# EAGLE design Blinkenlights (EAGLE 9.6.2)
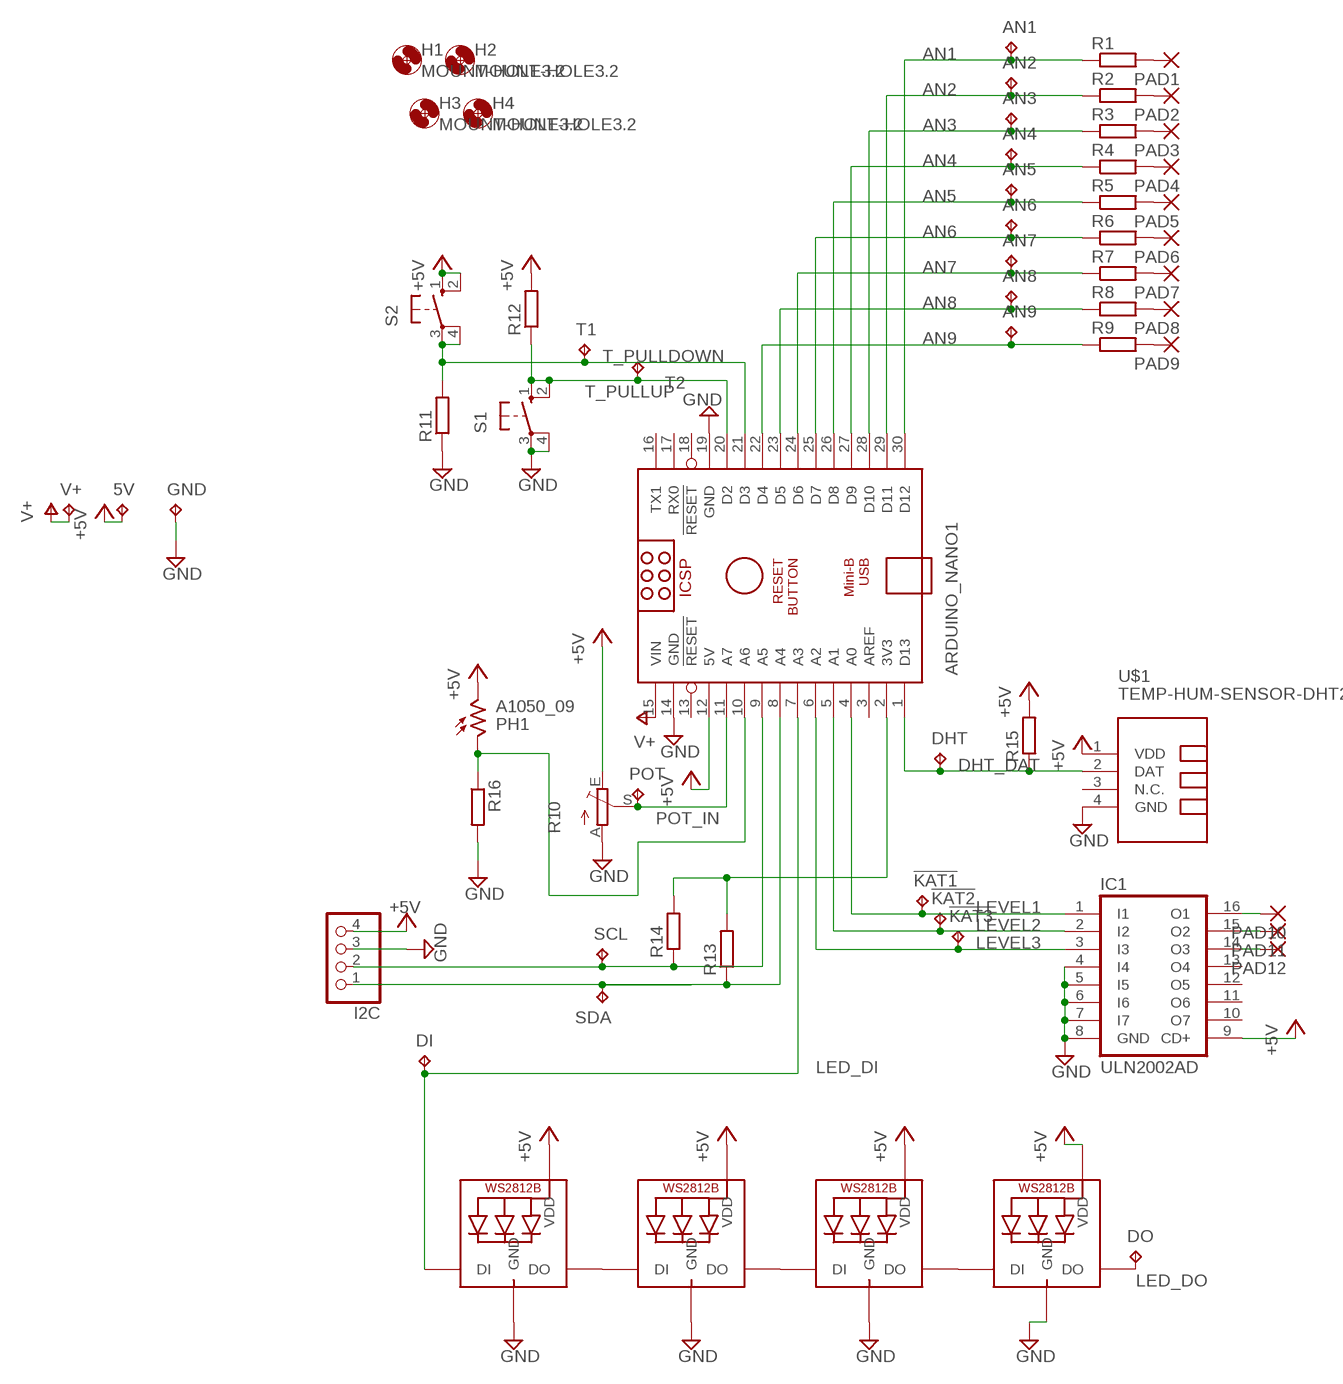
[diagram p0: schematic, sheet 1]

## Parts
5V  TPPAD1-17  [P1-17]
!KAT1  TPB1,27  [B1,27]
!KAT2  TPB1,27  [B1,27]
!KAT3  TPB1,27  [B1,27]
AN1  TPB1,27  [B1,27]
AN2  TPB1,27  [B1,27]
AN3  TPB1,27  [B1,27]
AN4  TPB1,27  [B1,27]
AN5  TPB1,27  [B1,27]
AN6  TPB1,27  [B1,27]
AN7  TPB1,27  [B1,27]
AN8  TPB1,27  [B1,27]
AN9  TPB1,27  [B1,27]
ARDUINO_NANO1  ARDUINO_NANO  [ARDUINO_NANO]
DHT  TPB1,27  [B1,27]
DI  TPB1,27  [B1,27]
DO  TPB1,27  [B1,27]
GND  TPPAD1-17  [P1-17]
H1  MOUNT-HOLE3.2  [3,2]
H2  MOUNT-HOLE3.2  [3,2]
H3  MOUNT-HOLE3.2  [3,2]
H4  MOUNT-HOLE3.2  [3,2]
I2C  PINHD-1X4  [1X04]
IC1  ULN2002AD  [SO16]
LED1  WS2812B5050  [WS2812B]
LED2  WS2812B5050  [WS2812B]
LED3  WS2812B5050  [WS2812B]
LED4  WS2812B5050  [WS2812B]
PAD1  2,54/1,1  [2,54/1,1]
PAD2  2,54/1,1  [2,54/1,1]
PAD3  2,54/1,1  [2,54/1,1]
PAD4  2,54/1,1  [2,54/1,1]
PAD5  2,54/1,1  [2,54/1,1]
PAD6  2,54/1,1  [2,54/1,1]
PAD7  2,54/1,1  [2,54/1,1]
PAD8  2,54/1,1  [2,54/1,1]
PAD9  2,54/1,1  [2,54/1,1]
PAD10  2,54/1,1  [2,54/1,1]
PAD11  2,54/1,1  [2,54/1,1]
PAD12  2,54/1,1  [2,54/1,1]
PH1  A1050_09  [T0-46-A10XX]
POT  TPB1,27  [B1,27]
R1  R-EU_R0603  [R0603]
R2  R-EU_R0603  [R0603]
R3  R-EU_R0603  [R0603]
R4  R-EU_R0603  [R0603]
R5  R-EU_R0603  [R0603]
R6  R-EU_R0603  [R0603]
R7  R-EU_R0603  [R0603]
R8  R-EU_R0603  [R0603]
R9  R-EU_R0603  [R0603]
R10  TRIM_EU-RJ9W  [RJ9W]
R11  R-EU_R0805  [R0805]
R12  R-EU_R0805  [R0805]
R13  R-EU_R0805  [R0805]
R14  R-EU_R0805  [R0805]
R15  R-EU_R0805  [R0805]
R16  R-EU_R0805  [R0805]
S1  10-XX  [B3F-10XX]
S2  10-XX  [B3F-10XX]
SCL  TPB1,27  [B1,27]
SDA  TPB1,27  [B1,27]
T1  TPB1,27  [B1,27]
T2  TPB1,27  [B1,27]
U$1  TEMP-HUM-SENSOR-DHT22  [TEMP-HUM-SENSOR-DHT22]
V+  TPPAD1-17  [P1-17]

## Nets
+5V [Supply]: 5V.TP ARDUINO_NANO1.12(5V) I2C.4 IC1.9(CD+) LED1.1-VDD(VDD) LED2.1-VDD(VDD) LED3.1-VDD(VDD) LED4.1-VDD(VDD) PH1.2 R10.E R12.2 R15.2 S2.1(S) S2.2(S1) U$1.1(VDD)
AN1 [Signal]: AN1.TP ARDUINO_NANO1.30(D12) R1.1
AN2 [Signal]: AN2.TP ARDUINO_NANO1.29(D11) R2.1
AN3 [Signal]: AN3.TP ARDUINO_NANO1.28(D10) R3.1
AN4 [Signal]: AN4.TP ARDUINO_NANO1.27(D9) R4.1
AN5 [Signal]: AN5.TP ARDUINO_NANO1.26(D8) R5.1
AN6 [Signal]: AN6.TP ARDUINO_NANO1.25(D7) R6.1
AN7 [Signal]: AN7.TP ARDUINO_NANO1.24(D6) R7.1
AN8 [Signal]: AN8.TP ARDUINO_NANO1.23(D5) R8.1
AN9 [Signal]: AN9.TP ARDUINO_NANO1.22(D4) R9.1
DHT_DAT [Signal]: ARDUINO_NANO1.1(D13) DHT.TP R15.1 U$1.2(DAT)
GND [Supply]: ARDUINO_NANO1.14(GND) ARDUINO_NANO1.19(GND) GND.TP I2C.3 IC1.4(I4) IC1.5(I5) IC1.6(I6) IC1.7(I7) IC1.8(GND) LED1.3-GND(GND) LED2.3-GND(GND) LED3.3-GND(GND) LED4.3-GND(GND) R10.A R11.1 R16.2 S1.3(P) S1.4(P1) U$1.4(GND)
LED_DI [Signal]: ARDUINO_NANO1.7(A3) DI.TP LED1.4-DIN(DI)
LED_DO [Signal]: DO.TP LED4.2-DOUT(DO)
LEVEL1 [Supply]: !KAT1.TP ARDUINO_NANO1.4(A0) IC1.1(I1)
LEVEL2 [Supply]: !KAT2.TP ARDUINO_NANO1.5(A1) IC1.2(I2)
LEVEL3 [Supply]: !KAT3.TP ARDUINO_NANO1.6(A2) IC1.3(I3)
N$1: PAD1.1(P) R1.2
N$2: PAD2.1(P) R2.2
N$3: PAD3.1(P) R3.2
N$4: PAD4.1(P) R4.2
N$5: PAD5.1(P) R5.2
N$6: PAD6.1(P) R6.2
N$7: PAD7.1(P) R7.2
N$8: PAD8.1(P) R8.2
N$9: PAD9.1(P) R9.2
N$10: IC1.16(O1) PAD10.1(P)
N$11: IC1.15(O2) PAD11.1(P)
N$12: IC1.14(O3) PAD12.1(P)
N$13: LED1.2-DOUT(DO) LED2.4-DIN(DI)
N$14: LED2.2-DOUT(DO) LED3.4-DIN(DI)
N$15: ARDUINO_NANO1.2(3V3) R13.2 R14.2
N$16: LED3.2-DOUT(DO) LED4.4-DIN(DI)
N$17: ARDUINO_NANO1.10(A6) PH1.1 R16.1
N$37: ARDUINO_NANO1.8(A4) I2C.1 R13.1 SDA.TP
N$38: ARDUINO_NANO1.9(A5) I2C.2 R14.1 SCL.TP
POT_IN [Signal]: ARDUINO_NANO1.11(A7) POT.TP R10.S
T_PULLDOWN [Signal]: ARDUINO_NANO1.21(D3) R11.2 S2.3(P) S2.4(P1) T1.TP
T_PULLUP [Signal]: ARDUINO_NANO1.20(D2) R12.1 S1.1(S) S1.2(S1) T2.TP
V+ [Supply]: ARDUINO_NANO1.15(VIN) V+.TP
Unconnected: ARDUINO_NANO1.3(AREF) ARDUINO_NANO1.13(!RESET) ARDUINO_NANO1.16(TX1) ARDUINO_NANO1.17(RX0) ARDUINO_NANO1.18(!RESET) IC1.10(O7) IC1.11(O6) IC1.12(O5) IC1.13(O4) U$1.3(N.C.)

## Library data of the parts
5V !KAT1-!KAT3 AN1-AN9 DHT DI DO GND POT SCL SDA T1 T2 V+ = testpad:TP: Test pad
ARDUINO_NANO1 = ArduinoNanoV30:ARDUINO_NANO: Arduino Nano V3.0 Overview: The Arduino Nano is a small, complete, and breadboard-friendly board based on the ATmega328 (Arduino Nano 3.x) or ATmega168 (Arduino Nano 2.x). It has more or less the same functionality of the Arduino Duemilanove, but in a different package. It lacks only a DC power jack, and works with a Mini-B USB cable instead of a standard one. The Nano was designed and is being produced by Gravitech. Specifications: Microcontroller Atmel ATmega168 or ATmega328 Operating Voltage (logic level) 5 V Input Voltage (recommended) 7-12 V Input Voltage (limits) 6-20 V Digital I/O Pins 14 (of which 6 provide PWM output) Analog Input Pins 8 DC Current per I/O Pin 40 mA Flash Memory 16 KB (ATmega168) or 32 KB (ATmega328) of which 2 KB used by bootloader SRAM 1 KB (ATmega168) or 2 KB (ATmega328) EEPROM 512 bytes (ATmega168) or 1 KB (ATmega328) Clock Speed 16 MHz Dimensions 0.73" x 1.70" Length 45 mm Width 18 mm Weigth 5 g Power: The Arduino Nano can be powered via the Mini-B USB connection, 6-20V unregulated external power supply (pin 30), or 5V regulated external power supply (pin 27). The power source is automatically selected to the highest voltage source. Memory: The ATmega168 has 16 KB of flash memory for storing code (of which 2 KB is used for the bootloader); the ATmega328 has 32 KB, (also with 2 KB used for the bootloader). The ATmega168 has 1 KB of SRAM and 512 bytes of EEPROM (which can be read and written with the EEPROM library); the ATmega328 has 2 KB of SRAM and 1 KB of EEPROM. Input and Output: Each of the 14 digital pins on the Nano can be used as an input or output, using pinMode(), digitalWrite(), and digitalRead() functions. They operate at 5 volts. Each pin can provide or receive a maximum of 40 mA and has an internal pull-up resistor (disconnected by default) of 20-50 kOhms. In addition, some pins have specialized functions. Visit Arduino - ArduinoBoardNano <https://www.arduino.cc/en/Main/ArduinoBoardNano>
H1-H4 = holes:MOUNT-HOLE: MOUNTING HOLE with drill center marker
I2C = pinhead:PINHD-1X4: PIN HEADER
IC1 = uln-udn:ULN2002A: DRIVER ARRAY
LED1-LED4 = adafruit:WS2812B
PAD1-PAD12 = wirepad:2,54/1,1: THROUGH-HOLE PAD
PH1 = photo-elements:A10: Sensor Robust Light Sensing Applications Outdoor Light Sensing Application Source: http://optoelectronics.perkinelmer.com/content/Datasheets/DTS_PhotocellsA1050.pdf
R1-R9 R11-R16 = rcl:R-EU_: RESISTOR, European symbol; SPICEPREFIX: R
R10 = pot:TRIM_EU-: POTENTIOMETER
S1 S2 = switch-omron:10-XX: OMRON SWITCH; MPN: B3F-1000; OC_FARNELL: 176432; OC_NEWARK: 36M3542
U$1 = diy-modules:TEMP-HUM-SENSOR-DHT22: DHT22 - digital humidity & temperature sensor Also known as: AM2302 AM2302 datasheet available here: http://akizukidenshi.com/download/ds/aosong/AM2302.pdf Click here to find device on ebay.com <http://www.ebay.com/sch/dht22+digital+sensor>

## Net classes
0 default: width 0.254 mm, clearance 0.254 mm
1 Signal: width 0.254 mm, clearance 0.254 mm
2 Supply: width 0.356 mm, clearance 0.254 mm

## Board
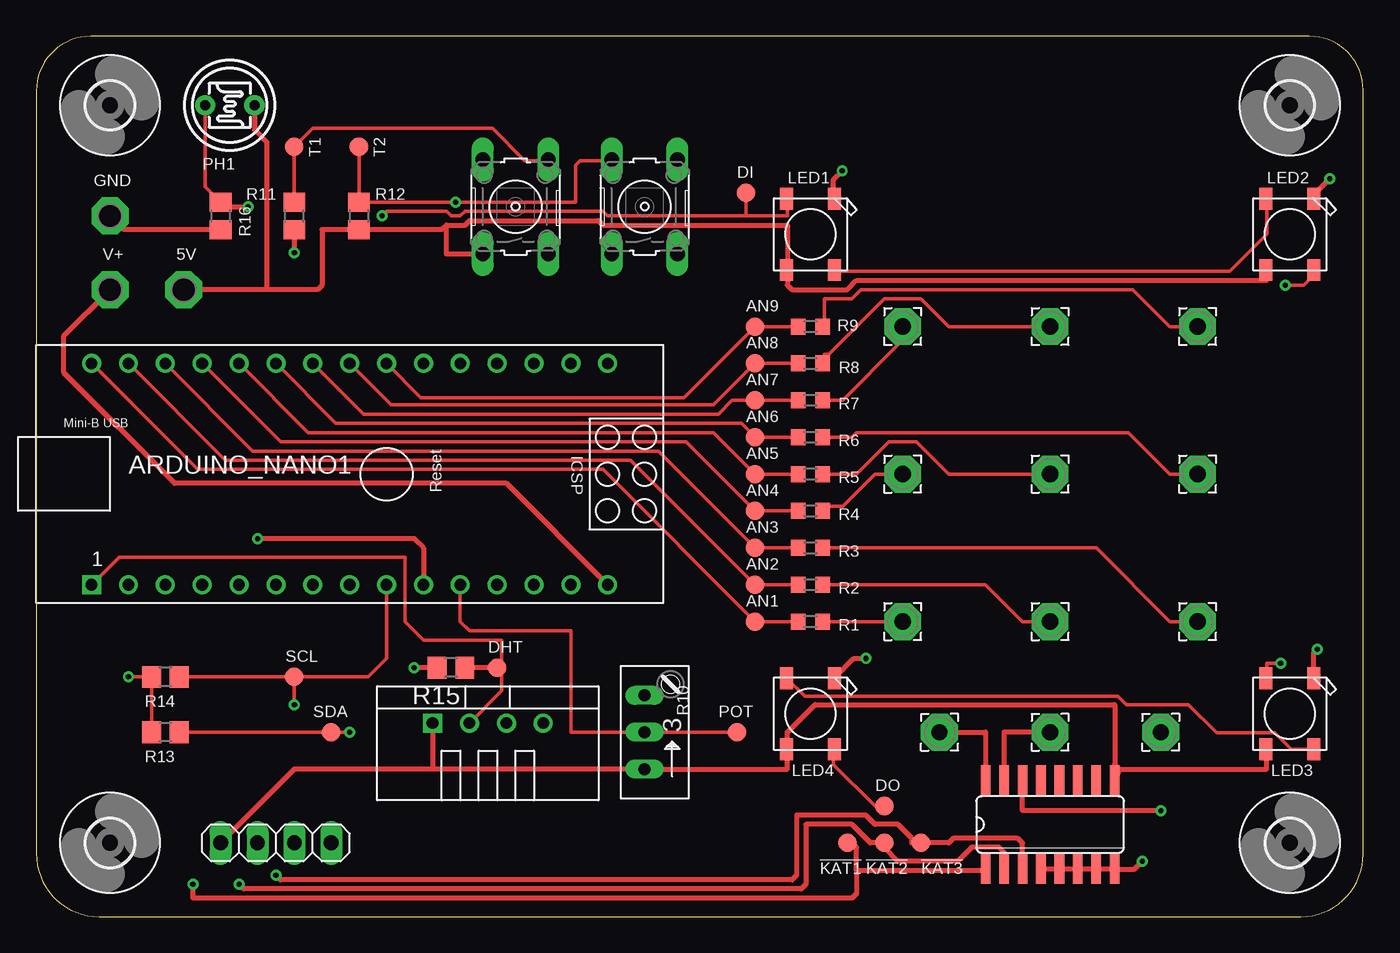
[diagram p1: board, top side]
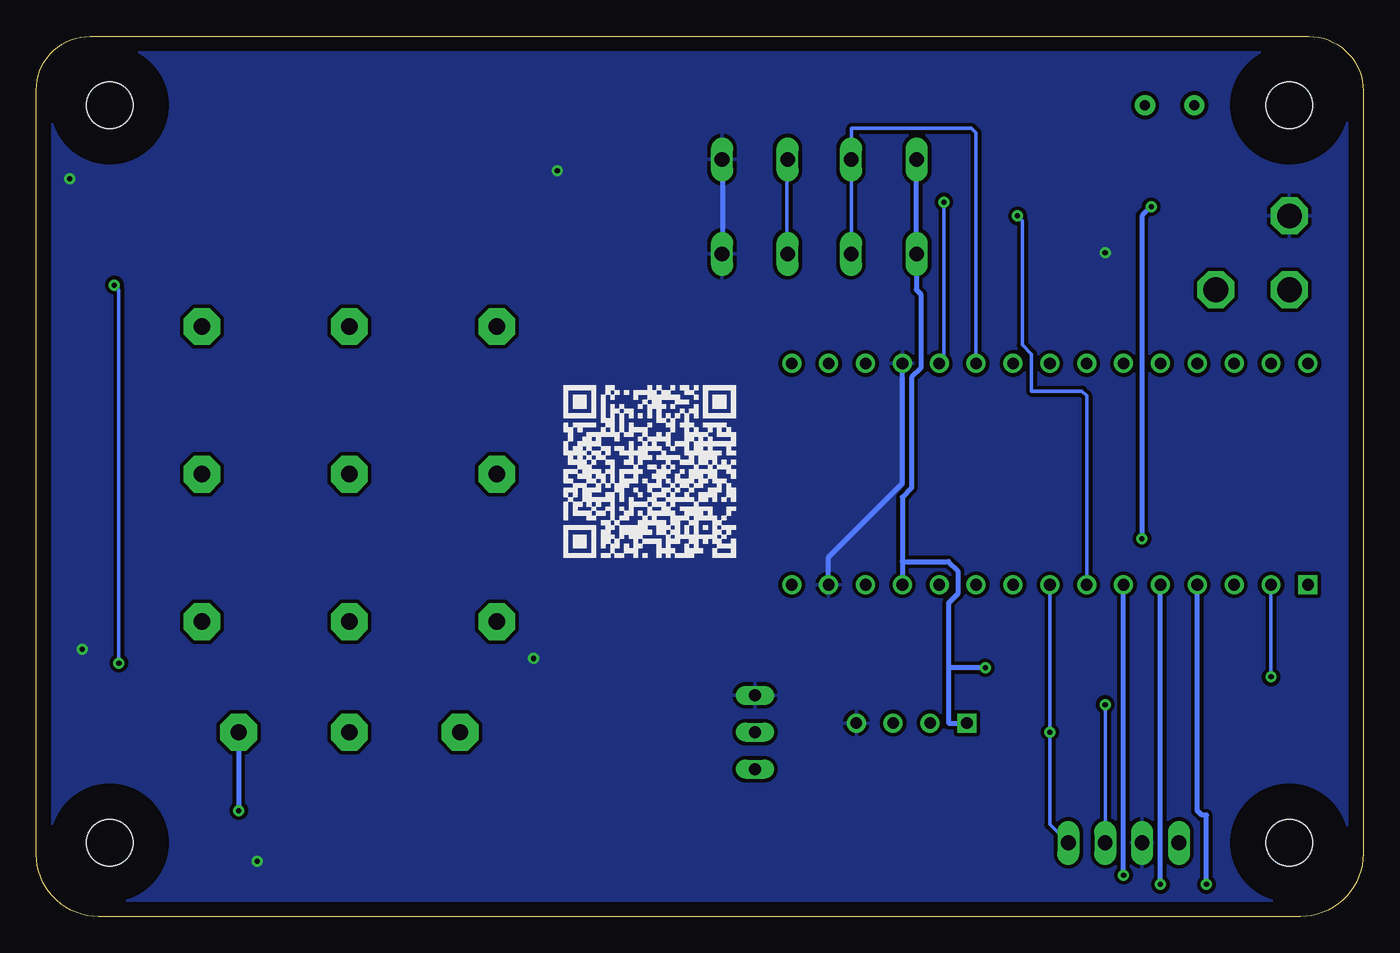
[diagram p2: board, bottom side, seen from below]

Size 91.42 x 60.63 mm. Coordinates in mm from the lower left corner, seen from the top.
Outline: 87.7,60.63 3.75,60.63 arc90 0,56.88 0,4.34 arc90 4.34,0 87.12,0 arc90 91.42,4.3 91.42,56.91 arc90 87.7,60.63
Copper layers (1*16): Top 0.035mm / dielectric 1.5mm / Bottom 0.035mm
Design rules "default": minimum track width 6mil, minimum drill 0.35mm, track to track 6mil, track to pad 6mil, pad to pad 6mil, via to via 6mil, smd to smd 6mil, copper to edge 40mil, drill to drill 6mil, minimum pad ring 10mil, minimum via ring 8mil, stop-mask expansion 4mil, vias tented up to drill 0mil, thermal gap 10mil

### Footprints (pad centres in the part's own frame; a part is rotated, then mirrored left to right if it is on the bottom)
P1-17 = drill 1.702 pad 2.54 octagon: TP 0,0
B1,27 = smd 1.27 x 1.27: TP 0,0
ARDUINO_NANO = drill 0.8 square: 1 -20.32,-7.62 | drill 0.8: 2 -17.78,-7.62; 3 -15.24,-7.62; 4 -12.7,-7.62; 5 -10.16,-7.62; 6 -7.62,-7.62; 7 -5.08,-7.62; 8 -2.54,-7.62; 9 0,-7.62; 10 2.54,-7.62; 11 5.08,-7.62; 12 7.62,-7.62; 13 10.16,-7.62; 14 12.7,-7.62; 15 15.24,-7.62; 16 15.24,7.62; 17 12.7,7.62; 18 10.16,7.62; 19 7.62,7.62; 20 5.08,7.62; 21 2.54,7.62; 22 0,7.62; 23 -2.54,7.62; 24 -5.08,7.62; 25 -7.62,7.62; 26 -10.16,7.62; 27 -12.7,7.62; 28 -15.24,7.62; 29 -17.78,7.62; 30 -20.32,7.62
3,2 = hole 3.2: 0,0
1X04 = drill 1.016 long: 1 -3.81,0; 2 -1.27,0; 3 1.27,0; 4 3.81,0
SO16 = smd 0.66 x 2.032: 1 -4.445,-3.073; 2 -3.175,-3.073; 3 -1.905,-3.073; 4 -0.635,-3.073; 5 0.635,-3.073; 6 1.905,-3.073; 7 3.175,-3.073; 8 4.445,-3.073; 9 4.445,3.073; 10 3.175,3.073; 11 1.905,3.073; 12 0.635,3.073; 13 -0.635,3.073; 14 -1.905,3.073; 15 -3.175,3.073; 16 -4.445,3.073
WS2812B = smd 1.5 x 0.9: 1-VDD 2.45,-1.65; 2-DOUT 2.45,1.65; 3-GND -2.45,1.65; 4-DIN -2.45,-1.65
2,54/1,1 = drill 1.118 pad 2.54 octagon: 1 0,0
T0-46-A10XX = drill 0.7 pad 1.4: 1 -1.7,0; 2 1.7,0
R0603 = smd 1 x 1.1: 1 -0.85,0; 2 0.85,0
RJ9W = drill 0.813 long: A 2.54,0.635; E -2.54,0.635; S 0,0.635
R0805 = smd 1.3 x 1.5: 1 -0.95,0; 2 0.95,0
B3F-10XX = drill 1.016 long: 1 -3.251,2.261; 2 3.251,2.261; 3 -3.251,-2.261; 4 3.251,-2.261
TEMP-HUM-SENSOR-DHT22 = drill 0.8 square: 1 -3.81,0 | drill 0.8: 2 -1.27,0; 3 1.27,0; 4 3.81,0

### Placement (x,y rotation side)
5V  10.16,43.18 0 top
!KAT1  55.88,5.08 0 top
!KAT2  58.42,5.08 0 top
!KAT3  60.96,5.08 0 top
AN1  49.53,20.32 0 top
AN2  49.53,22.86 0 top
AN3  49.53,25.4 0 top
AN4  49.53,27.94 0 top
AN5  49.53,30.48 0 top
AN6  49.53,33.02 0 top
AN7  49.53,35.56 0 top
AN8  49.53,38.1 0 top
AN9  49.53,40.64 0 top
ARDUINO_NANO1  24.13,30.48 0 top
DHT  31.75,17.14 0 top
DI  48.89,49.85 0 top
DO  58.42,7.62 0 top
GND  5.08,48.26 0 top
H1  5.08,55.88 0 top
H2  5.08,5.08 0 top
H3  86.36,5.08 0 top
H4  86.36,55.88 0 top
I2C  16.51,5.08 180 top
IC1  69.85,6.35 0 top
LED1  53.34,46.99 270 top
LED2  86.36,46.99 270 top
LED3  86.36,13.97 270 top
LED4  53.34,13.97 270 top
PAD1  59.69,20.32 0 top
PAD2  69.85,20.32 0 top
PAD3  80.01,20.32 0 top
PAD4  59.69,30.48 0 top
PAD5  69.85,30.48 0 top
PAD6  80.01,30.48 0 top
PAD7  59.69,40.64 0 top
PAD8  69.85,40.64 0 top
PAD9  80.01,40.64 0 top
PAD10  62.23,12.7 0 top
PAD11  69.85,12.7 0 top
PAD12  77.47,12.7 0 top
PH1  13.33,55.88 0 top
POT  48.26,12.7 0 top
R1  53.34,20.32 0 top
R2  53.34,22.86 0 top
R3  53.34,25.4 0 top
R4  53.34,27.94 0 top
R5  53.34,30.48 0 top
R6  53.34,33.02 0 top
R7  53.34,35.56 0 top
R8  53.34,38.1 0 top
R9  53.34,40.64 0 top
R10  42.54,12.7 90 top
R11  17.78,48.26 90 top
R12  22.23,48.26 270 top
R13  8.89,12.7 180 top
R14  8.89,16.51 180 top
R15  28.58,17.14 180 top
R16  12.7,48.26 270 top
S1  41.91,48.9 90 top
S2  33.02,48.9 90 top
SCL  17.78,16.51 0 top
SDA  20.32,12.7 0 top
T1  17.78,53.02 270 top
T2  22.23,53.02 270 top
U$1  31.12,13.34 0 top
V+  5.08,43.18 0 top

### Tracks (layer width: path | path; a pad name or v marks a point on that pad's centre or on a via)
+5V  (via drill 0.35)
  Top 0.356: 74.61,10.16 84.77,10.16 84.77,11.43 LED3.1-VDD | 74.61,10.16 74.3,9.84 IC1.9 74.61,10.16 | U$1.1 27.31,10.16 | 27.31,10.16 R10.E 51.75,10.16 51.75,11.43 LED4.1-VDD 51.75,11.75 51.75,12.7 53.66,14.61 74.3,14.61 74.3,10.48 74.61,10.16 | R12.2 27.94,47.31 28.26,47.62 | 28.26,47.62 28.26,45.64 S2.1 | 28.26,47.62 29.53,47.62 29.85,47.94 38.73,47.94 39.05,47.62 51.75,47.62 51.75,44.77 LED1.1-VDD 51.75,44.45 51.75,43.5 52.07,43.18 55.88,43.18 56.52,43.81 84.77,43.81 84.77,44.45 LED2.1-VDD | 15.88,43.18 19.37,43.18 19.69,43.5 19.69,47.31 R12.2 | 15.88,43.18 5V.TP | R12.2 | 27.31,10.16 17.78,10.16 I2C.4 | R15.2 v26.04,17.14 | PH1.2 15.04,54.18 15.88,53.34 15.88,43.18
  Bottom 0.356: 31.75,24.45 31.75,28.89 31.12,29.53 31.12,37.15 30.48,37.78 30.48,42.86 30.8,43.18 30.8,45.4 S2.1 30.8,45.72 30.8,52.07 S2.2 | 31.75,24.45 ARDUINO_NANO1.12 | U$1.1 28.58,13.34 28.58,17.14 | 28.58,17.14 28.58,21.59 27.94,22.23 27.94,23.81 28.58,24.45 31.75,24.45 | v26.04,17.14 28.58,17.14
AN1
  Top 0.254: R1.1 AN1.TP 39.05,30.8 11.11,30.8 ARDUINO_NANO1.30
AN2
  Top 0.254: R2.1 AN2.TP 40.96,31.43 13.02,31.43 ARDUINO_NANO1.29
AN3
  Top 0.254: R3.1 AN3.TP 42.86,32.07 14.92,32.07 ARDUINO_NANO1.28
AN4
  Top 0.254: R4.1 AN4.TP 44.77,32.7 16.83,32.7 ARDUINO_NANO1.27
AN5
  Top 0.254: R5.1 AN5.TP 46.67,33.34 18.73,33.34 ARDUINO_NANO1.26
AN6
  Top 0.254: R6.1 AN6.TP 48.58,33.97 20.64,33.97 ARDUINO_NANO1.25
AN7
  Top 0.254: R7.1 AN7.TP 47.94,35.56 46.99,34.61 22.54,34.61 ARDUINO_NANO1.24
AN8
  Top 0.254: R8.1 AN8.TP 46.67,35.24 24.45,35.24 ARDUINO_NANO1.23
AN9
  Top 0.254: ARDUINO_NANO1.22 26.48,35.75 44.64,35.75 AN9.TP R9.1
DHT_DAT
  Top 0.254: U$1.2 32.07,15.56 32.07,16.83 32.07,17.46 | 32.07,17.46 32.07,19.05 26.67,19.05 25.4,20.32 25.4,24.77 5.71,24.77 ARDUINO_NANO1.1 | DHT.TP 32.07,17.46
  Top 0.356: 32.07,16.83 DHT.TP R15.1
GND  (via drill 0.35)
  Top 0.356: 55.24,49.21 LED1.3-GND 54.93,49.53 54.93,50.79 v55.52,51.38 | 88.27,49.53 LED2.3-GND | 87.95,49.53 LED2.3-GND | 54.93,16.19 LED4.3-GND 56.35,17.78 v57.15,17.78 | 87.95,16.19 LED3.3-GND 88.01,18.16 v88.27,18.41 | IC1.4 IC1.5 IC1.6 IC1.7 IC1.8 75.67,3.28 v76.2,3.81 | LED2.3-GND 88.01,49.73 v89.1,50.83 | 17.46,46.99 R11.1 v17.78,45.72 | R16.2 6.03,47.31 GND.TP
  Bottom 0.356: S1.3 44.13,45.72 44.13,52.07 S1.4 | ARDUINO_NANO1.19 31.75,29.84 36.83,24.77 ARDUINO_NANO1.14
  pour Bottom: 0,0 0,60.96 91.44,60.96 91.44,0
LED_DI  (via drill 0.35)
  Top 0.254: 48.89,48.26 DI.TP | LED1.4-DIN 51.75,49.21 51.75,48.26 48.89,48.26 | v23.81,48.26 24.13,48.58 28.26,48.58 28.58,48.26 29.21,48.26 29.53,48.58 39.05,48.58 39.37,48.26 48.89,48.26
  Bottom 0.254: ARDUINO_NANO1.7 19.05,35.88 19.37,36.2 22.86,36.2 22.86,38.73 23.5,39.37 23.5,47.94 v23.81,48.26
LED_DO
  Top 0.254: DO.TP 57.78,7.62 54.93,10.48 54.93,11.43 LED4.2-DOUT
LEVEL1  (via drill 0.35)
  Top 0.356: !KAT1.TP 56.2,5.08 56.52,4.76 56.52,3.17 | 56.52,3.17 65.41,3.17 IC1.1 | v10.79,2.22 10.79,1.27 56.2,1.27 56.52,1.59 56.52,3.17
  Bottom 0.356: ARDUINO_NANO1.4 11.43,7.3 11.11,6.99 10.79,6.99 v10.79,2.22
LEVEL2  (via drill 0.35)
  Top 0.356: IC1.2 66.68,4.45 66.36,4.76 64.45,4.76 63.5,3.81 59.37,3.81 58.42,4.76 !KAT2.TP 57.47,5.08 56.2,6.35 53.02,6.35 53.02,2.22 52.7,1.91 14.29,1.91 v13.97,2.22
  Bottom 0.356: v13.97,2.22 ARDUINO_NANO1.5
LEVEL3  (via drill 0.35)
  Top 0.356: IC1.3 67.95,5.08 67.63,5.4 63.18,5.4 62.86,5.08 !KAT3.TP 60.32,5.08 60.32,5.4 59.37,6.35 57.78,6.35 57.15,6.99 52.39,6.99 52.39,2.86 52.07,2.54 16.83,2.54 v16.51,2.86
  Bottom 0.356: v16.51,2.86 ARDUINO_NANO1.6
N$1
  Top 0.254: PAD1.1 R1.2
N$2
  Top 0.254: R2.2 65.41,22.86 67.95,20.32 PAD2.1
N$3
  Top 0.254: R3.2 73.03,25.4 78.11,20.32 PAD3.1
N$4
  Top 0.254: PAD4.1 57.78,30.48 55.56,28.26 54.29,28.26 54.29,27.94 R4.2
N$5
  Top 0.254: R5.2 56.52,30.48 58.74,32.7 60.64,32.7 62.86,30.48 PAD5.1
N$6
  Top 0.254: R6.2 56.2,33.02 56.52,33.34 75.25,33.34 78.11,30.48 PAD6.1
N$7
  Top 0.254: R7.2 55.56,35.56 59.37,39.37 59.37,40.64 PAD7.1
N$8
  Top 0.254: PAD8.1 62.86,40.64 60.96,42.55 58.42,42.55 54.61,38.73 54.29,38.73 54.29,38.1 R8.2
N$9
  Top 0.254: PAD9.1 78.11,40.64 75.57,43.18 56.83,43.18 56.2,42.55 54.29,42.55 54.29,40.64 R9.2
N$10
  Top 0.356: IC1.16 65.41,12.7 PAD10.1
N$11
  Top 0.356: IC1.15 66.68,12.7 PAD11.1
N$12  (via drill 0.35)
  Top 0.356: IC1.14 67.95,7.3 v77.47,7.3
  Bottom 0.356: PAD12.1 v77.47,7.3
N$13
  Top 0.254: LED1.2-DOUT 55.24,44.45 82.23,44.45 84.77,46.99 84.77,49.21 LED2.4-DIN
N$14  (via drill 0.35)
  Top 0.254: 87.95,44.13 88.27,44.45 LED2.2-DOUT 87.95,44.13 | v85.73,17.46 84.77,17.46 84.77,16.51 LED3.4-DIN | v86.04,43.5 87.31,43.5 87.95,44.13
  Bottom 0.254: v85.73,17.46 85.73,43.18 v86.04,43.5
N$15  (via drill 0.35)
  Top 0.254: v6.35,16.51 R14.2 R13.2
  Bottom 0.254: ARDUINO_NANO1.2 v6.35,16.51
N$16
  Top 0.254: LED4.4-DIN 52.95,15.16 74.53,15.16 75.09,14.61 79.38,14.61 81.33,12.65 85.32,12.65 86.45,11.52 LED3.2-DOUT
N$17  (via drill 0.35)
  Top 0.254: R16.1 11.63,50.27 PH1.1
  Top 0.356: R16.1 13.02,48.9 v14.61,48.9 | v15.24,26.04 26.04,26.04 26.67,25.4 ARDUINO_NANO1.10
  Bottom 0.356: v14.61,48.9 15.24,48.26 v15.24,26.04
N$37  (via drill 0.35)
  Top 0.254: v21.59,12.7 SDA.TP R13.1
  Bottom 0.254: ARDUINO_NANO1.8 v21.59,12.7 21.59,6.35 I2C.1
N$38  (via drill 0.35)
  Top 0.254: ARDUINO_NANO1.9 24.13,17.78 22.86,16.51 SCL.TP | SCL.TP R14.1 | SCL.TP v17.78,14.61
  Bottom 0.254: v17.78,14.61 I2C.2
POT_IN
  Top 0.254: POT.TP R10.S 36.83,12.7 36.83,19.68 29.85,19.68 29.21,20.32 ARDUINO_NANO1.11
T_PULLDOWN
  Top 0.254: R11.2 T1.TP 19.05,54.29 31.43,54.29 33.66,52.07 35.24,52.07 S2.4
  Bottom 0.254: ARDUINO_NANO1.21 26.67,53.98 26.99,54.29 35.24,54.29 35.24,52.39 S2.4 35.24,52.07 35.24,45.72 S2.3
T_PULLUP  (via drill 0.35)
  Top 0.254: R12.1 T2.TP | R12.1 v28.89,49.21 37.15,49.21 37.15,51.75 37.46,52.07 39.37,52.07 S1.2 | R12.1
  Bottom 0.254: S1.1 39.69,45.72 39.69,52.07 S1.2 | ARDUINO_NANO1.20 28.89,38.42 v28.89,49.21
V+
  Top 0.356: ARDUINO_NANO1.15 32.38,29.84 9.53,29.84 1.91,37.47 1.91,40.01 V+.TP

### Text on the board
201bmp: C:/Users/SKOELL/Desktop/qr-code.bmp